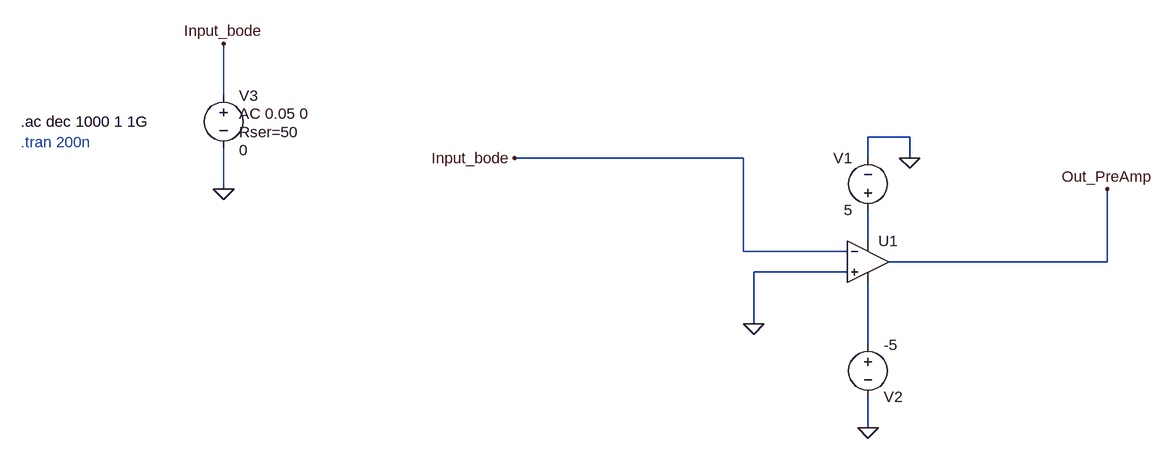
[diagram p0: schematic preamp_open_loop.asc]
preamp_open_loop.asc, the LTspice schematic file:
Version 4
SHEET 1 880 680
WIRE -720 -80 -720 -160
WIRE 336 -16 272 -16
WIRE 80 16 -272 16
WIRE 272 16 272 -16
WIRE 336 16 336 -16
WIRE -720 64 -720 0
WIRE 272 144 272 96
WIRE 80 160 80 16
WIRE 240 160 80 160
WIRE 640 176 640 64
WIRE 640 176 304 176
WIRE 240 192 96 192
WIRE 96 272 96 192
WIRE 272 304 272 208
WIRE 272 432 272 384
FLAG 272 432 0
FLAG 336 16 0
FLAG 96 272 0
FLAG 640 64 Out_PreAmp
FLAG -272 16 Input_bode
FLAG -720 64 0
FLAG -720 -160 Input_bode
SYMBOL voltage 272 112 R180
WINDOW 0 24 96 Left 2
WINDOW 3 24 16 Left 2
WINDOW 123 0 0 Left 0
WINDOW 39 0 0 Left 0
SYMATTR InstName V1
SYMATTR Value 5
SYMBOL voltage 272 288 R0
WINDOW 0 24 96 Left 2
WINDOW 3 24 16 Left 2
WINDOW 123 0 0 Left 0
WINDOW 39 0 0 Left 0
SYMATTR InstName V2
SYMATTR Value -5
SYMBOL OpAmps\\UniversalOpAmp1 272 176 R0
SYMATTR InstName U1
SYMATTR Value2 Avol=750 GBW=359Meg Vos=0
SYMBOL voltage -720 -96 R0
WINDOW 123 24 44 Left 2
WINDOW 39 24 72 Left 2
WINDOW 3 24 100 Left 2
SYMATTR Value2 AC 0.05 0
SYMATTR SpiceLine Rser=50
SYMATTR Value 0
SYMATTR InstName V3
TEXT -1032 -8 Left 2 ;.tran 200n
TEXT -1032 -40 Left 2 !.ac dec 1000 1 1G

The netlist it stands for:
* preamp_open_loop.asc
V1 N001 0 5
V2 N002 0 -5
XU1 0 Input_bode N001 N002 Out_PreAmp level1 Avol=750 GBW=359Meg Vos=0 En=0 Enk=0 In=0 Ink=0 Rin=500Meg  ; pins In+ In- V+ V- OUT
V3 Input_bode 0 0 AC 0.05 0 Rser=50
* .tran 200n
.ac dec 1000 1 1G
.lib UniversalOpAmp1.lib
.backanno
.end